# EAGLE schematic Motor_Test_Bench (EAGLE 9.5.0)
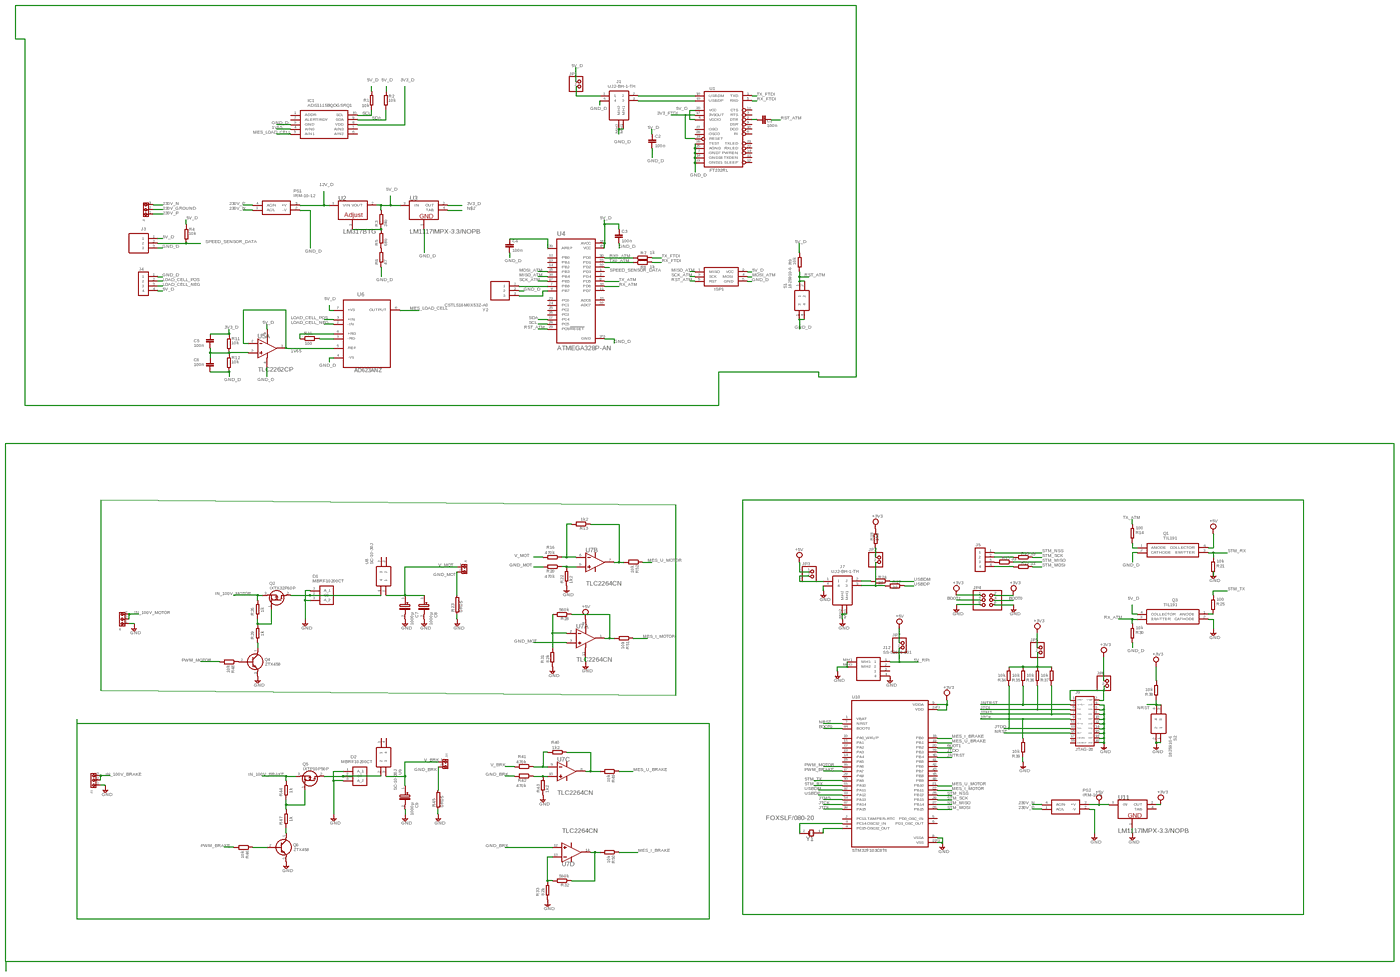
[diagram p0: schematic, sheet 1, overview]
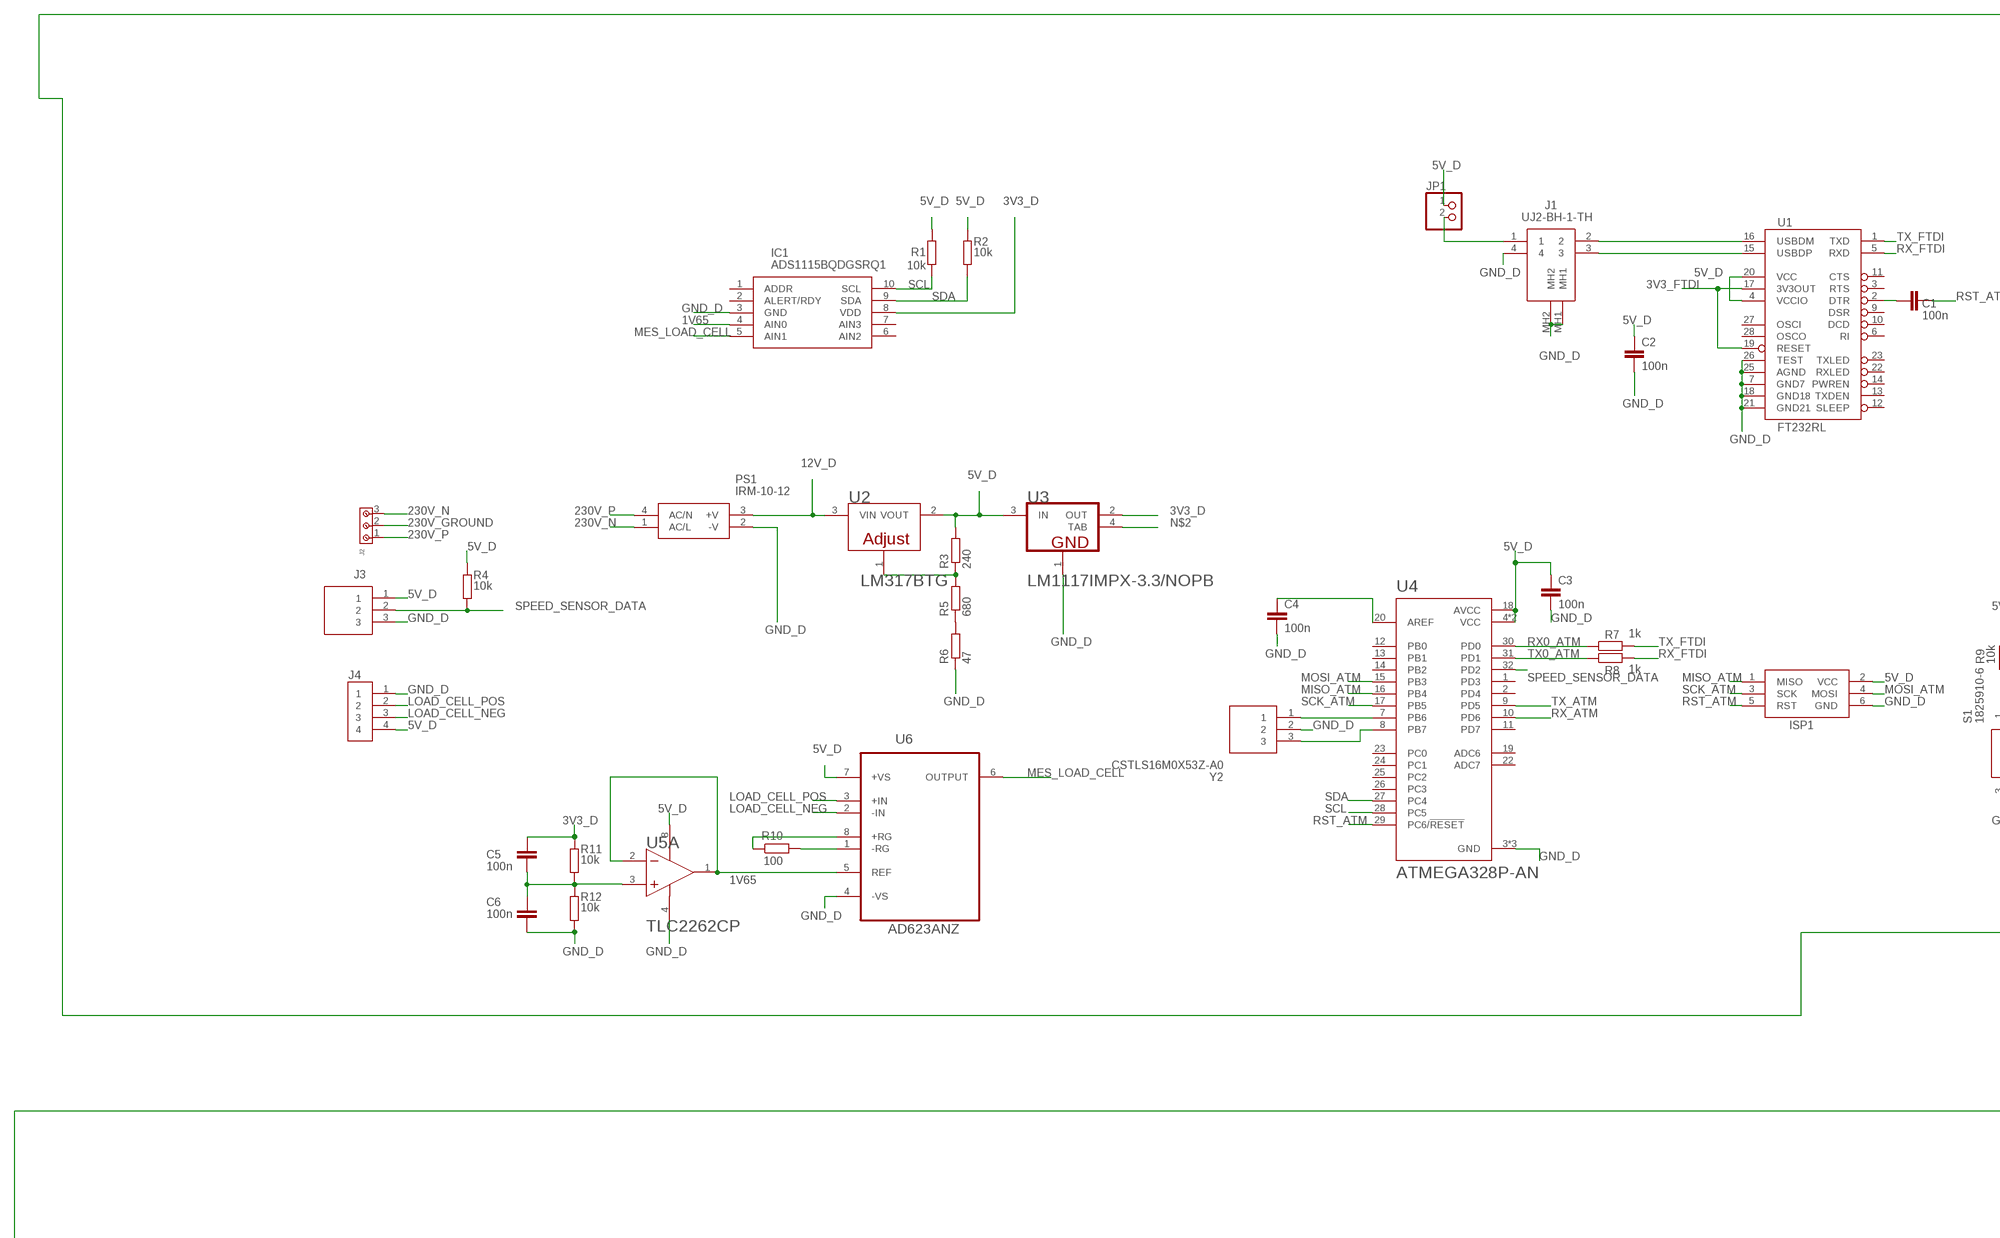
[diagram p1: schematic, sheet 1, part 1 of 4]
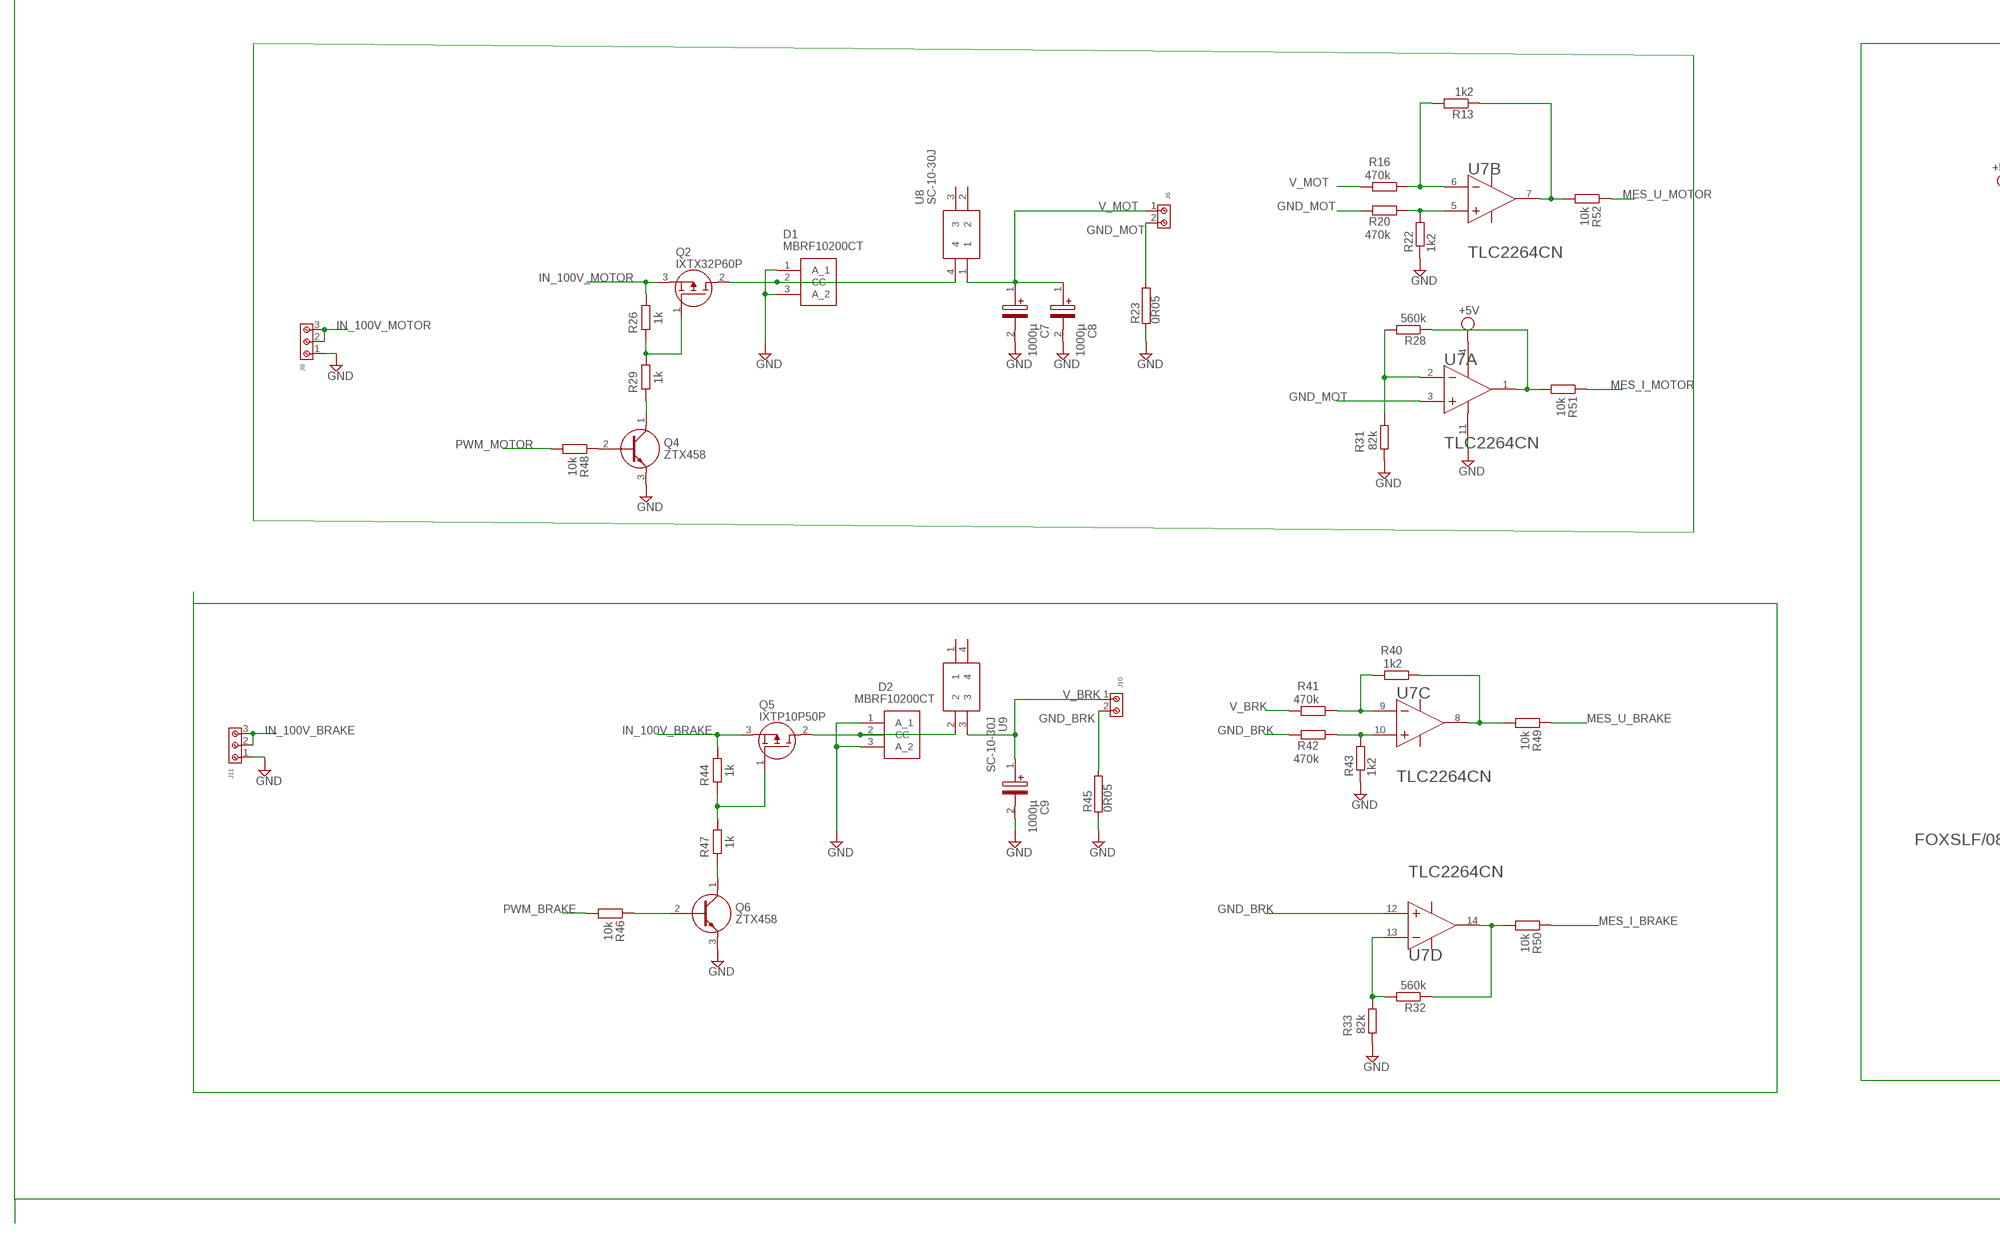
[diagram p2: schematic, sheet 1, part 2 of 4]
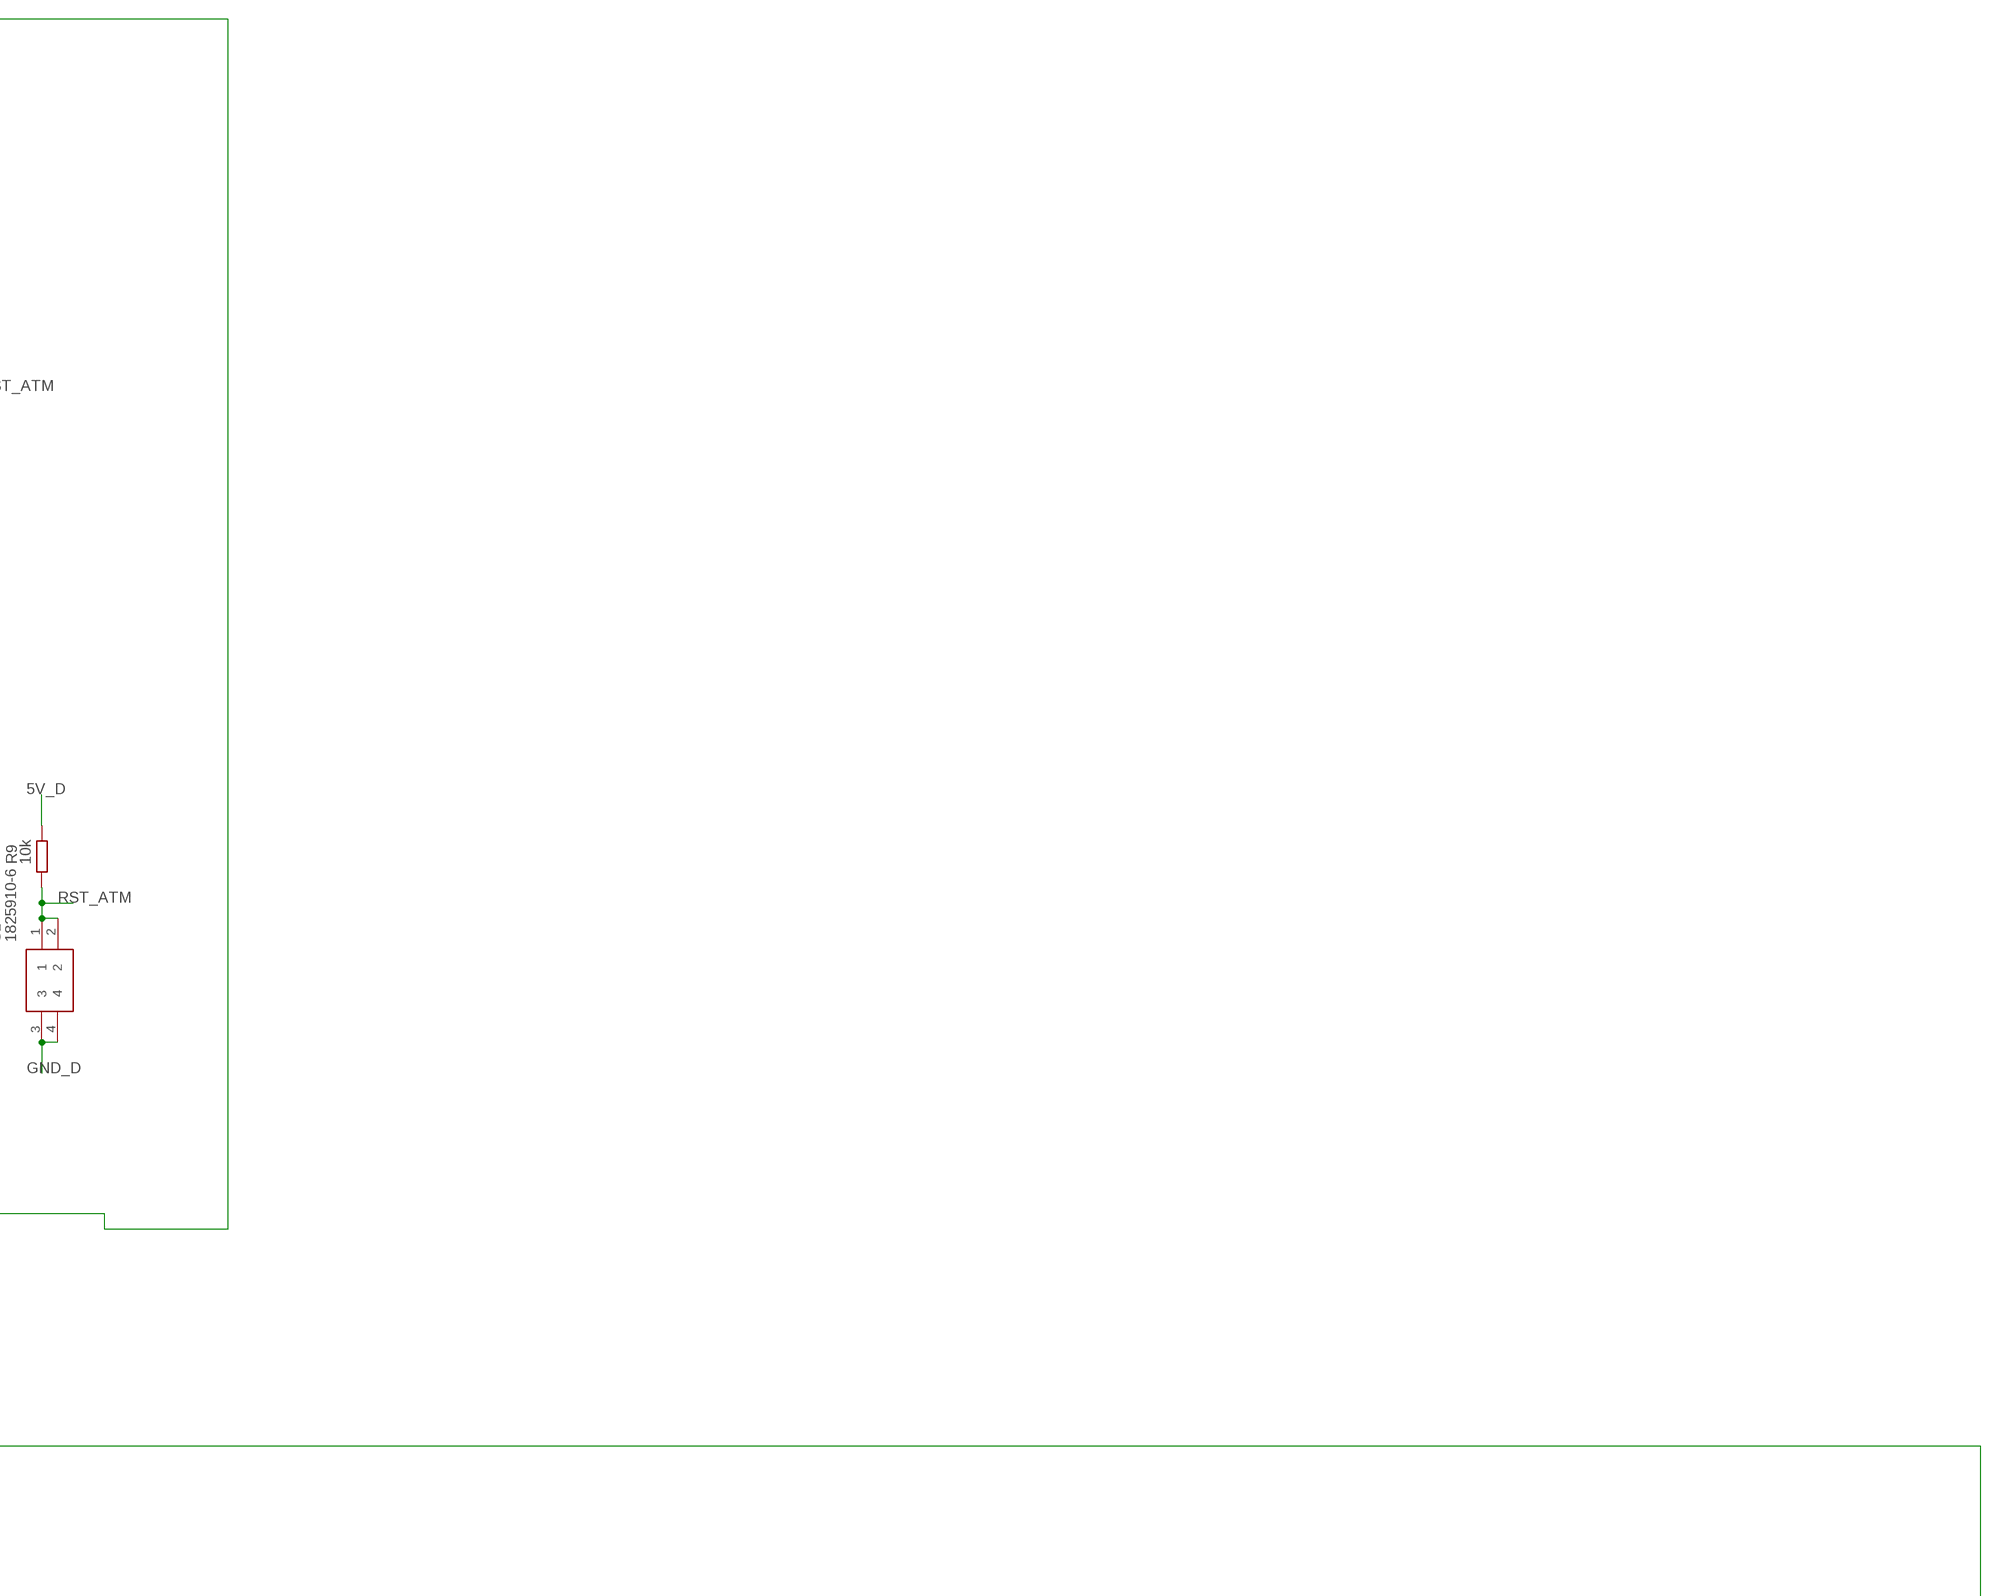
[diagram p3: schematic, sheet 1, part 3 of 4]
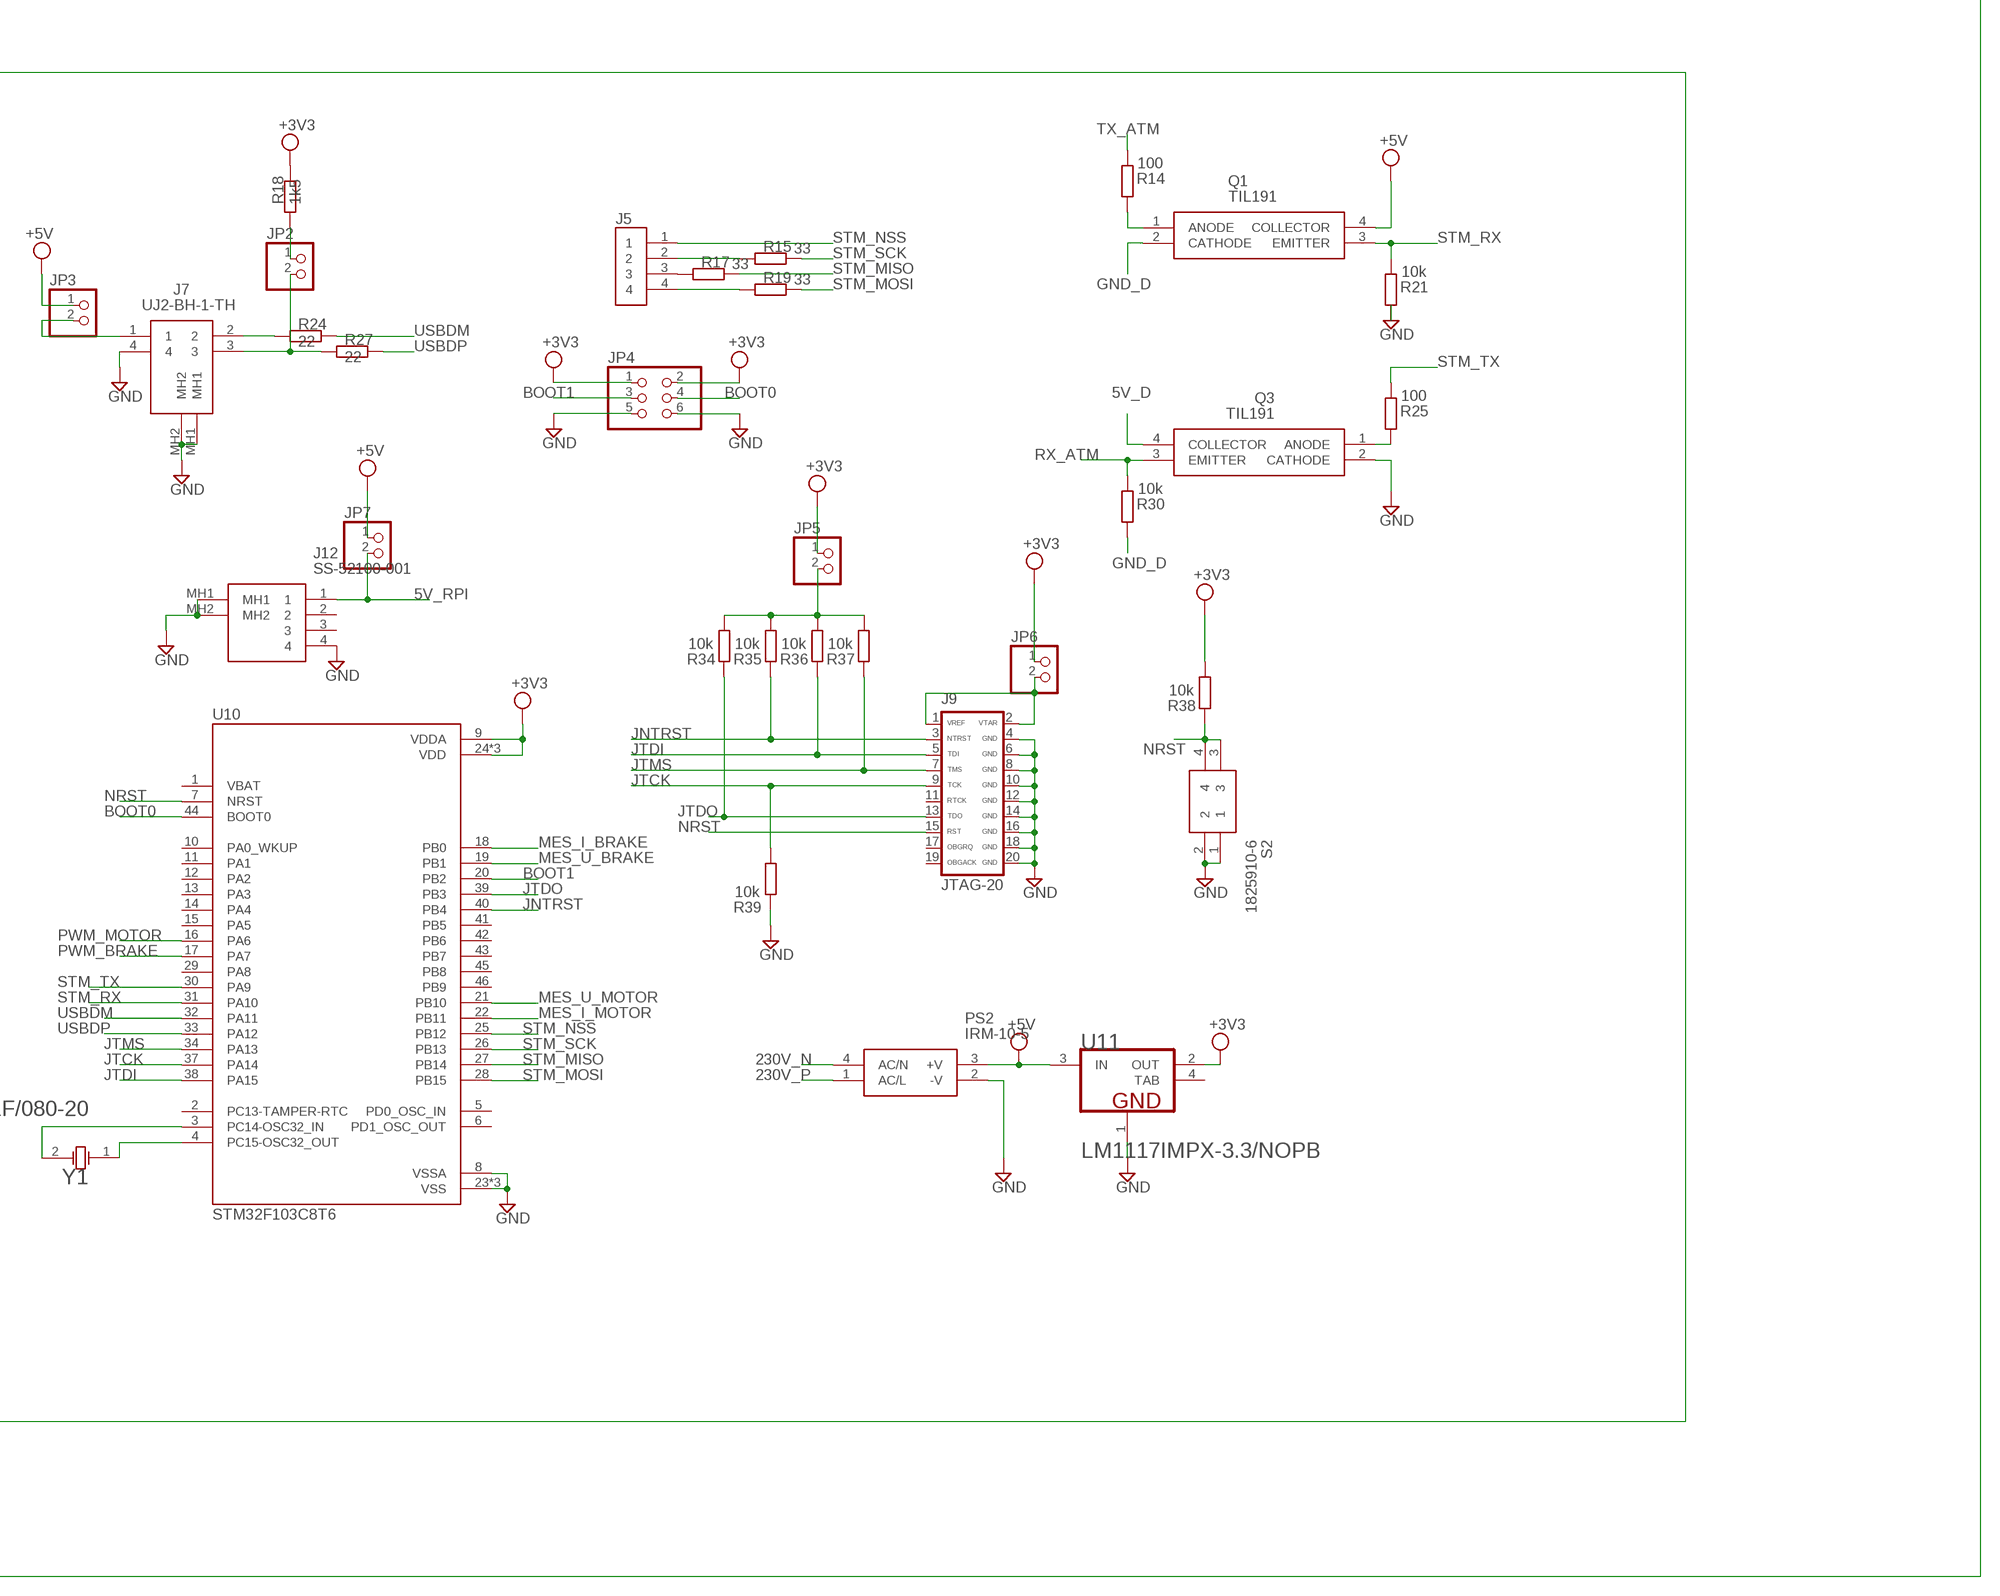
[diagram p4: schematic, sheet 1, part 4 of 4]

## Parts
C1  100n  CC0805KRX7R9BB104  [CAP_0805]
C2  100n  CC0805KRX7R9BB104  [CAP_0805]
C3  100n  CC0805KRX7R9BB104  [CAP_0805]
C4  100n  CC0805KRX7R9BB104  [CAP_0805]
C5  100n  C-EUC0805  [C0805]
C6  100n  C-EUC0805  [C0805]
C7  1000µ  SLPX102M200C4P3  [SLPX102M200C4P3]
C8  1000µ  SLPX102M200C4P3  [SLPX102M200C4P3]
C9  1000µ  SLPX102M200C4P3  [SLPX102M200C4P3]
D1  MBRF10200CT  [TO254P490X1000X2143-3P]
D2  MBRF10200CT  [TO254P490X1000X2143-3P]
IC1  ADS1115BQDGSRQ1  [SOP50P490X110-10N]
ISP1  AVRISP-6  [AVRISP]
J1  UJ2-BH-1-TH  [UJ2BH1TH]
J2  691210910003  [691210910003]
J3  B3B-XH-A(LF)(SN)  [SHDR3W64P0X250_1X3_990X575X700]
J4  B4B-XH-A(LF)(SN)  [JST_B4B-XH-A(LF)(SN)]
J5  B4B-XH-A(LF)(SN)  [JST_B4B-XH-A(LF)(SN)]
J6  691210910002  [691210910002]
J7  UJ2-BH-1-TH  [UJ2BH1TH]
J8  691210910003  [691210910003]
J9  JTAG-20  [JTAG-20]
J10  691210910002  [691210910002]
J11  691210910003  [691210910003]
J12  SS-52100-001  [SS52100001]
JP1  PINHD-1X2  [1X02]
JP2  PINHD-1X2  [1X02]
JP3  PINHD-1X2  [1X02]
JP4  PINHD-2X3  [2X03]
JP5  PINHD-1X2  [1X02]
JP6  PINHD-1X2  [1X02]
JP7  PINHD-1X2  [1X02]
PS1  IRM-10-12  [IRM-10]
PS2  IRM-10-5  [IRM-10]
Q1  TIL191  [DIP762W58P254L450H584Q4N]
Q2  IXTX32P60P  [TO545P521X1594X2566-3P]
Q3  TIL191  [DIP762W58P254L450H584Q4N]
Q4  ZTX458  [ZTX458]
Q5  IXTP10P50P  [TO254P483X1028X1700-3P]
Q6  ZTX458  [ZTX458]
R1  10k  R-EU_R0805  [R0805]
R2  10k  R-EU_R0805  [R0805]
R3  240  R-EU_R0805  [R0805]
R4  10k  R-EU_R0805  [R0805]
R5  680  R-EU_R0805  [R0805]
R6  47  R-EU_R0805  [R0805]
R7  1k  R-EU_R0805  [R0805]
R8  1k  R-EU_R0805  [R0805]
R9  10k  R-EU_R0805  [R0805]
R10  100  R-EU_R0805  [R0805]
R11  10k  R-EU_R0805  [R0805]
R12  10k  R-EU_R0805  [R0805]
R13  1k2  R-EU_R0805  [R0805]
R14  100  R-EU_R0805  [R0805]
R15  33  R-EU_M0805  [M0805]
R16  470k  R-EU_R0805  [R0805]
R17  33  R-EU_M0805  [M0805]
R18  1k5  R-EU_R0805  [R0805]
R19  33  R-EU_M0805  [M0805]
R20  470k  R-EU_R0805  [R0805]
R21  10k  R-EU_R0805  [R0805]
R22  1k2  R-EU_R0805  [R0805]
R23  0R05  RRS05_69-70  [RS05_69-70]
R24  22  R-EU_R0805  [R0805]
R25  100  R-EU_R0805  [R0805]
R26  1k  R-EU_0204/7  [0204/7]
R27  22  R-EU_R0805  [R0805]
R28  560k  R-EU_R0805  [R0805]
R29  1k  R-EU_0204/7  [0204/7]
R30  10k  R-EU_R0805  [R0805]
R31  82k  R-EU_R0805  [R0805]
R32  560k  R-EU_R0805  [R0805]
R33  82k  R-EU_R0805  [R0805]
R34  10k  R-EU_M0805  [M0805]
R35  10k  R-EU_M0805  [M0805]
R36  10k  R-EU_M0805  [M0805]
R37  10k  R-EU_M0805  [M0805]
R38  10k  R-EU_R0805  [R0805]
R39  10k  R-EU_M0805  [M0805]
R40  1k2  R-EU_R0805  [R0805]
R41  470k  R-EU_R0805  [R0805]
R42  470k  R-EU_R0805  [R0805]
R43  1k2  R-EU_R0805  [R0805]
R44  1k  R-EU_0204/7  [0204/7]
R45  0R05  RRS05_69-70  [RS05_69-70]
R46  10k  R-EU_0204/7  [0204/7]
R47  1k  R-EU_0204/7  [0204/7]
R48  10k  R-EU_0204/7  [0204/7]
R49  10k  R-EU_M0805  [M0805]
R50  10k  R-EU_M0805  [M0805]
R51  10k  R-EU_M0805  [M0805]
R52  10k  R-EU_M0805  [M0805]
S1  1825910-6  [1825910-6]
S2  1825910-6  [1825910-6]
U1  FT232RL  FT232RLSSOP  [SSOP28DB]
U2  ON_SEMI_LM317BTGON_SEMI_LM317BTG_0_0  [ON_SEMI_LM317BTG_0]
U3  NATIONAL_SEMICONDUCTOR_LM1117IMPX-3.3-NOPBNATIONAL_SEMICONDUCTOR_LM1117IMPX-3.3-NOPB_0_2  [NATIONAL_SEMICONDUCTOR_LM1117IMPX-3.3-NOPB_2]
U4  ATMEGA328P-AN  [QFP80P900X900X120-32N]
U5  TEXAS_INSTRUMENTS_TLC2262CPTEXAS_INSTRUMENTS_TLC2262CP_0_0  [TEXAS_INSTRUMENTS_TLC2262CP_0]
U6  AD623ANZ  [DIP254P762X533-8]
U7  TEXAS_INSTRUMENTS_TLC2264CNTEXAS_INSTRUMENTS_TLC2264CN_0_0  [TEXAS_INSTRUMENTS_TLC2264CN_0]
U8  SC-10-30J  [SC-10-30J]
U9  SC-10-30J  [SC-10-30J]
U10  STM32F103C8T6  [QFP50P900X900X160-48N]
U11  NATIONAL_SEMICONDUCTOR_LM1117IMPX-3.3-NOPBNATIONAL_SEMICONDUCTOR_LM1117IMPX-3.3-NOPB_0_2  [NATIONAL_SEMICONDUCTOR_LM1117IMPX-3.3-NOPB_2]
Y1  FOX_ELECTRONICS_FOXSLF-080-20FOX_ELECTRONICS_FOXSLF-080-20_0_0  [FOX_ELECTRONICS_FOXSLF-080-20_0]
Y2  CSTLS16M0X53Z-A0  [CSTLS16M0X53ZA0]

## Nets
1V65: IC1.4(AIN0) U5.1(A:OUT1) U5.2(A:IN1-) U6.5(REF)
3V3_D: C5.1 IC1.8(VDD) R11.1 U3.2(OUT)
3V3_FTDI: U1.17(3V3OUT) U1.19(RESET)
5V_D: C2.1 C3.1 ISP1.2(VCC) J3.1 J4.4 JP1.1 Q3.4(COLLECTOR) R1.2 R2.2 R3.2 R4.1 R9.2 U1.4(VCCIO) U1.20(VCC) U2.2(VOUT) U3.3(IN) U4.4(VCC) U4.6(VCC) U4.18(AVCC) U5.8(A:VDD+) U6.7(+VS)
5V_RPI: J12.1 JP7.2
12V_D: PS1.3(+V) U2.3(VIN)
230V_GROUND: J2.2
230V_N: J2.3 PS1.1(AC/L) PS2.4(AC/N)
230V_P: J2.1 PS1.4(AC/N) PS2.1(AC/L)
+3V3: JP4.1 JP4.2 JP5.1 JP6.1 R18.1 R38.2 U10.9(VDDA) U10.24(VDD) U10.36(VDD) U10.48(VDD) U11.2(OUT)
+5V: JP3.1 JP7.1 PS2.3(+V) Q1.4(COLLECTOR) U7.4(A:VDD+) U11.3(IN)
BOOT0: JP4.4 U10.44(BOOT0)
BOOT1: JP4.3 U10.20(PB2)
GND: C7.2(-) C8.2(-) C9.2(-) D1.1(A_1) D1.3(A_2) D2.1(A_1) D2.3(A_2) J7.4 J7.MH1 J7.MH2 J8.1 J9.4(GND) J9.6(GND) J9.8(GND) J9.10(GND) J9.12(GND) J9.14(GND) J9.16(GND) J9.18(GND) J9.20(GND) J11.1 J12.4 J12.MH1 J12.MH2 JP4.5 JP4.6 PS2.2(-V) Q3.2(CATHODE) Q4.3(C) Q6.3(C) R21.1 R22.1 R23.1 R31.2 R33.2 R39.1 R43.1 R45.1 S2.1 S2.2 U7.11(A:VDD-/GND) U10.8(VSSA) U10.23(VSS) U10.35(VSS) U10.47(VSS) U11.1(GND)
GND_BRK: J10.2 R42.2 R45.2 U7.12(D:IN4+)
GND_D: C2.2 C3.2 C4.2 C6.2 IC1.3(GND) ISP1.6(GND) J1.4 J1.MH1 J1.MH2 J3.3 J4.1 PS1.2(-V) Q1.2(CATHODE) R6.1 R12.2 R30.1 S1.3 S1.4 U1.7(GND7) U1.18(GND18) U1.21(GND21) U1.25(AGND) U1.26(TEST) U3.1(GND) U4.3(GND) U4.5(GND) U4.21(GND) U5.4(A:VDD-/GND) U6.4(-VS) Y2.2
GND_MOT: J6.2 R20.2 R23.2 U7.3(A:IN1+)
IN_100V_BRAKE: J11.2 J11.3 Q5.3(S) R44.2
IN_100V_MOTOR: J8.2 J8.3 Q2.3(S) R26.2
JNTRST: J9.3(NTRST) R35.1 U10.40(PB4)
JTCK: J9.9(TCK) R39.2 U10.37(PA14)
JTDI: J9.5(TDI) R36.1 U10.38(PA15)
JTDO: J9.13(TDO) R34.1 U10.39(PB3)
JTMS: J9.7(TMS) R37.1 U10.34(PA13)
LOAD_CELL_NEG: J4.3 U6.2(-IN)
LOAD_CELL_POS: J4.2 U6.3(+IN)
MES_I_BRAKE: R50.1 U10.18(PB0)
MES_I_MOTOR: R51.1 U10.22(PB11)
MES_LOAD_CELL: IC1.5(AIN1) U6.6(OUTPUT)
MES_U_BRAKE: R49.1 U10.19(PB1)
MES_U_MOTOR: R52.1 U10.21(PB10)
MISO_ATM: ISP1.1(MISO) U4.16(PB4)
MOSI_ATM: ISP1.4(MOSI) U4.15(PB3)
N$1: D1.2(CC) Q2.2(D) U8.4
N$2: U3.4(TAB)
N$3: R5.1 R6.2
N$5: R3.1 R5.2 U2.1(ADJUST)
N$6: J7.2 R24.2
N$7: J7.3 JP2.2 R27.2
N$8: JP2.1 R18.2
N$9: R28.2 R31.1 U7.2(A:IN1-)
N$10: Q2.1(G) R26.1 R29.2
N$11: Q4.1(E) R29.1
N$12: R13.2 R16.1 U7.6(B:IN2-)
N$13: R20.1 R22.2 U7.5(B:IN2+)
N$14: C1.2 U1.2(DTR)
N$15: C4.1 U4.20(AREF)
N$16: Q5.1(G) R44.1 R47.2
N$17: R32.2 R33.1 U7.13(D:IN4-)
N$18: Q6.2(B) R46.1
N$19: R42.1 R43.2 U7.10(C:IN3+)
N$20: R40.2 R41.1 U7.9(C:IN3-)
N$21: Q4.2(B) R48.1
N$22: Q6.1(E) R47.1
N$23: R28.1 R51.2 U7.1(A:OUT1)
N$25: J1.2 U1.16(USBDM)
N$26: R10.2 U6.1(-RG)
N$27: C5.2 C6.1 R11.2 R12.1 U5.3(A:IN1+)
N$28: R10.1 U6.8(+RG)
N$29: J1.3 U1.15(USBDP)
N$32: D2.2(CC) Q5.2(D) U9.2
N$34: Q1.1(ANODE) R14.1
N$35: Q3.1(ANODE) R25.1
N$36: J7.1 JP3.2
N$37: J9.1(VREF) J9.2(VTAR) JP6.2
N$38: JP5.2 R34.2 R35.2 R36.2 R37.2
N$39: J1.1 JP1.2
N$40: J5.2 R15.2
N$41: J5.3 R17.2
N$42: J5.4 R19.2
N$43: U10.4(PC15-OSC32_OUT) Y1.1
N$44: U10.3(PC14-OSC32_IN) Y1.2
N$45: R32.1 R50.2 U7.14(D:OUT4)
N$46: R40.1 R49.2 U7.8(C:OUT3)
N$47: R13.1 R52.2 U7.7(B:OUT2)
N$48: U4.7(PB6) Y2.1
N$49: U4.8(PB7) Y2.3
NRST: J9.15(RST) R38.1 S2.3 S2.4 U10.7(NRST)
PWM_BRAKE: R46.2 U10.17(PA7)
PWM_MOTOR: R48.2 U10.16(PA6)
RST_ATM: C1.1 ISP1.5(RST) R9.1 S1.1 S1.2 U4.29(PC6/!RESET)
RX0_ATM: R7.1 U4.30(PD0)
RX_ATM: Q3.3(EMITTER) R30.2 U4.10(PD6)
RX_FTDI: R8.2 U1.5(RXD)
SCK_ATM: ISP1.3(SCK) U4.17(PB5)
SCL: IC1.10(SCL) R1.1 U4.28(PC5)
SDA: IC1.9(SDA) R2.1 U4.27(PC4)
SPEED_SENSOR_DATA: J3.2 R4.2 U4.32(PD2)
STM_MISO: R17.1 U10.27(PB14)
STM_MOSI: R19.1 U10.28(PB15)
STM_NSS: J5.1 U10.25(PB12)
STM_RX: Q1.3(EMITTER) R21.2 U10.31(PA10)
STM_SCK: R15.1 U10.26(PB13)
STM_TX: R25.2 U10.30(PA9)
TX0_ATM: R8.1 U4.31(PD1)
TX_ATM: R14.2 U4.9(PD5)
TX_FTDI: R7.2 U1.1(TXD)
USBDM: R24.1 U10.32(PA11)
USBDP: R27.1 U10.33(PA12)
V_BRK: C9.1(+) J10.1 R41.2 U9.3
V_MOT: C7.1(+) C8.1(+) J6.1 R16.2 U8.1
Unconnected: IC1.1(ADDR) IC1.2(ALERT/RDY) IC1.6(AIN2) IC1.7(AIN3) J9.11(RTCK) J9.17(OBGRQ) J9.19(OBGACK) J12.2 J12.3 U1.3(RTS) U1.6(RI) U1.9(DSR) U1.10(DCD) U1.11(CTS) U1.12(SLEEP) U1.13(TXDEN) U1.14(PWREN) U1.22(RXLED) U1.23(TXLED) U1.27(OSCI) U1.28(OSCO) U4.1(PD3) U4.2(PD4) U4.11(PD7) U4.12(PB0) U4.13(PB1) U4.14(PB2) U4.19(ADC6) U4.22(ADC7) U4.23(PC0) U4.24(PC1) U4.25(PC2) U4.26(PC3) U5.5(B:IN2+) U5.6(B:IN2-) U5.7(B:OUT2) U8.2 U8.3 U9.1 U9.4 U10.1(VBAT) U10.2(PC13-TAMPER-RTC) U10.5(PD0_OSC_IN) U10.6(PD1_OSC_OUT) U10.10(PA0_WKUP) U10.11(PA1) U10.12(PA2) U10.13(PA3) U10.14(PA4) U10.15(PA5) U10.29(PA8) U10.41(PB5) U10.42(PB6) U10.43(PB7) U10.45(PB8) U10.46(PB9)

## Power pins joined to a net without a drawn wire
TAB: U11.4(TAB)

## Library data of the parts
C1-C4 = Resistor_Capacitor:CC0805KRX7R9BB104: CAP CER 0.1UF 50V X7R 0805 Manufacturer's datasheet <http://www.yageo.com/documents/recent/UPY-GPHC_X7R_6.3V-to-50V_18.pdf>; CREATED_BY: PCBLayout.com; DIGIKEY_PART_NUMBER: 311-1140-2-ND; MANUFACTURER: Yageo; MPN: CC0805KRX7R9BB104; PACKAGE: SMD 0805
C5 C6 = resistor:C-EU: CAPACITOR, European symbol
C7-C9 = SamacSys_Parts:SLPX102M200C4P3: Cornell-Dubilier 1000uF Electrolytic Capacitor 200V dc Through Hole - SLPX102M200C4P3 Source: Datasheet <http://uk.rs-online.com/web/p/products/7441199P>; DESCRIPTION: Cornell-Dubilier 1000uF Electrolytic Capacitor 200V dc Through Hole - SLPX102M200C4P3; HEIGHT: 47mm; MANUFACTURER_NAME: Cornell Dubilier; MANUFACTURER_PART_NUMBER: SLPX102M200C4P3; RS_PART_NUMBER: 7441199P; RS_PRICE-STOCK: http://uk.rs-online.com/web/p/products/7441199P
D1 D2 = SamacSys_Parts:MBRF10200CT: DIODE SCHOTTKY 5A ITO220AB Source: Datasheet <https://componentsearchengine.com/Datasheets/1/MBRF10200CT.pdf>; DESCRIPTION: DIODE SCHOTTKY 5A ITO220AB; HEIGHT: 4.9mm; MANUFACTURER_NAME: Diodes Inc.; MANUFACTURER_PART_NUMBER: MBRF10200CT; MOUSER_PART_NUMBER: 621-MBRF10200CT; MOUSER_PRICE-STOCK: https://www.mouser.com/Search/Refine.aspx?Keyword=621-MBRF10200CT
IC1 = SamacSys_Parts:ADS1115BQDGSRQ1: Automotive 16-Bit 860SPS 4-Ch Delta-Sigma ADC With PGA, Oscillator, VREF, Comparator, and I2C Source: Datasheet <http://www.ti.com/lit/gpn/ads1115-q1>; DESCRIPTION: Automotive 16-Bit 860SPS 4-Ch Delta-Sigma ADC With PGA, Oscillator, VREF, Comparator, and I2C; HEIGHT: 1.1mm; MANUFACTURER_NAME: Texas Instruments; MANUFACTURER_PART_NUMBER: ADS1115BQDGSRQ1; MOUSER_PART_NUMBER: 595-ADS1115BQDGSRQ1; MOUSER_PRICE-STOCK: https://www.mouser.com/Search/Refine.aspx?Keyword=595-ADS1115BQDGSRQ1
ISP1 = adafruit:AVRISP: AVR ISP HEADER Standard 6 pin header for AVR programming
J1 J7 = SamacSys_Parts:UJ2-BH-1-TH: USB Connectors USB 2.0 type B jack 4 pin Horizontal TH Source: Datasheet <https://componentsearchengine.com/Datasheets/1/UJ2-BH-1-TH.pdf>; DESCRIPTION: USB Connectors USB 2.0 type B jack 4 pin Horizontal TH; HEIGHT: 10mm; MANUFACTURER_NAME: CUI Devices; MANUFACTURER_PART_NUMBER: UJ2-BH-1-TH; MOUSER_PART_NUMBER: 490-UJ2-BH-1-TH; MOUSER_PRICE-STOCK: https://www.mouser.com/Search/Refine.aspx?Keyword=490-UJ2-BH-1-TH
J2 J8 J11 = Wurth_Connectors_WR-TBL Rising Cage Clamp:691210910003: WR-TBL Serie 2109 - 2.54 mm Horiz. Entry KIND PROPERTIES Pitch 2.54 mm MATERIAL PROPERTIES Insulator Material PA66 Insulator Flammability Rating UL94 V-0 Insulator Color Green Contact Material Brass Contact Plating Copper over Zinc Terminal Screw Material Steel Terminal Screw Plating Zinc Wire Guard Material Brass GENERAL INFORMATION Operating Temperature -40 up to +105 °C Compliance Lead free / RoHS ELECTRICAL PROPERTIES IR cULus 6 A Working Voltage [cULus] 150 V (AC) Withstanding Voltage [cULus] 1300 V (AC) Contact Resistance [cULus] 20 mΩ MECHANICAL PROPERTIES Wire Strip Length 4 up to 5 (mm) Screw M1.6 Solid Wire Section (AWG) 30 to 18 (AWG) Solid Wire Section (Metric) 0.0509 to 0.823 (mm²) Stranded Wire Section (AWG) 30 to 18 (AWG) Stranded Wire Section (Metric) 0.0509 to 0.823 (mm²) CERTIFICATION cULus Approval E315414 PACKAGING PROPERTIES Packaging Box <https://katalog.we-online.com/media/images/v2/o33231v209%20Family_WR-TBL_69121091000x.jpg> Details see: https://katalog.we-online.com/en/em/TBL_2_54_2109_HORIZONTAL_ENTRY_69121091000X Updated by Ella Wu 2019-11-12 2019(C) Wurth Elektronik; DATASHEET-URL: https://www.we-online.com/catalog/datasheet/691210910003.pdf; IR-UL: 6A; MOUNT: THT; PART-NUMBER: 691210910003; PINS: 3; PITCH: 2.54mm; TYPE: Horizontal; WIRE: 30 to 18 (AWG) 0.0509 to 0.823 (mm²); WORKING-VOLTAGE-UL: 150V (AC)
J3 = SamacSys_Parts:B3B-XH-A(LF)(SN): XH-2.5mm Header top entry 3 way JST XH Series, Series Number B3B, 2.5mm Pitch 3 Way 1 Row Straight PCB Header, Solder Termination, 3A Source: Datasheet; DESCRIPTION: XH-2.5mm Header top entry 3 way JST XH Series, Series Number B3B, 2.5mm Pitch 3 Way 1 Row Straight PCB Header, Solder Termination, 3A; HEIGHT: 7mm; MANUFACTURER_NAME: JST (JAPAN SOLDERLESS TERMINALS); MANUFACTURER_PART_NUMBER: B3B-XH-A(LF)(SN)
J4 J5 = B4B-XH-A_LF__SN_:B4B-XH-A(LF)(SN): XH Series 4 Position 2.5 mm Pitch Through Hole Crimp Top Entry Shrouded Header; AVAILABILITY: Unavailable; DESCRIPTION: Connector Header Through Hole 4 position 0.098 _2.50mm_; MF: JST Sales; MP: B4B-XH-A_LF__SN_; PACKAGE: None; PRICE: None
J6 J10 = Wurth_Connectors_WR-TBL Rising Cage Clamp:691210910002: WR-TBL Serie 2109 - 2.54 mm Horiz. Entry KIND PROPERTIES Pitch 2.54 mm MATERIAL PROPERTIES Insulator Material PA66 Insulator Flammability Rating UL94 V-0 Insulator Color Green Contact Material Brass Contact Plating Copper over Zinc Terminal Screw Material Steel Terminal Screw Plating Zinc Wire Guard Material Brass GENERAL INFORMATION Operating Temperature -40 up to +105 °C Compliance Lead free / RoHS ELECTRICAL PROPERTIES IR cULus 6 A Working Voltage [cULus] 150 V (AC) Withstanding Voltage [cULus] 1300 V (AC) Contact Resistance [cULus] 20 mΩ MECHANICAL PROPERTIES Wire Strip Length 4 up to 5 (mm) Screw M1.6 Solid Wire Section (AWG) 30 to 18 (AWG) Solid Wire Section (Metric) 0.0509 to 0.823 (mm²) Stranded Wire Section (AWG) 30 to 18 (AWG) Stranded Wire Section (Metric) 0.0509 to 0.823 (mm²) CERTIFICATION cULus Approval E315414 PACKAGING PROPERTIES Packaging Box <https://katalog.we-online.com/media/images/v2/o33231v209%20Family_WR-TBL_69121091000x.jpg> Details see: https://katalog.we-online.com/en/em/TBL_2_54_2109_HORIZONTAL_ENTRY_69121091000X Updated by Ella Wu 2019-11-12 2019(C) Wurth Elektronik; DATASHEET-URL: https://www.we-online.com/catalog/datasheet/691210910002.pdf; IR-UL: 6A; MOUNT: THT; PART-NUMBER: 691210910002; PINS: 2; PITCH: 2.54mm; TYPE: Horizontal; WIRE: 30 to 18 (AWG) 0.0509 to 0.823 (mm²); WORKING-VOLTAGE-UL: 150V (AC)
J9 = luminary-arm:JTAG-20: JTAG 20-Pin Programming/Debug Connector
J12 = SamacSys_Parts:SS-52100-001: STEWART CONNECTOR - SS-52100-001 - USB CONN, 2.0 TYPE A, RCPT, 4POS, TH Source: Datasheet <https://componentsearchengine.com/Datasheets/1/SS-52100-001.pdf>; DESCRIPTION: STEWART CONNECTOR - SS-52100-001 - USB CONN, 2.0 TYPE A, RCPT, 4POS, TH; HEIGHT: 6.9mm; MANUFACTURER_NAME: Bel-Stewart; MANUFACTURER_PART_NUMBER: SS-52100-001; MOUSER_PART_NUMBER: 530-SS-52100-001; MOUSER_PRICE-STOCK: https://www.mouser.com/Search/Refine.aspx?Keyword=530-SS-52100-001
JP1-JP3 JP5-JP7 = DC_LOAD_AU:PINHD-1X2: PIN HEADER
JP4 = pinhead:PINHD-2X3: PIN HEADER
PS1 = SamacSys_Parts:IRM-10-12: Power Supply Encapsulated PCB 12V 10W Source: Datasheet <http://uk.rs-online.com/web/p/products/1358930>; ALLIED_NUMBER: 70387819; DESCRIPTION: Power Supply Encapsulated PCB 12V 10W; HEIGHT: mm; MANUFACTURER_NAME: Mean Well; MANUFACTURER_PART_NUMBER: IRM-10-12; RS_PART_NUMBER: 1358930; RS_PRICE-STOCK: http://uk.rs-online.com/web/p/products/1358930
PS2 = SamacSys_Parts:IRM-10-5: AC/DC Power Modules 5V 2A 10W 85-264Vin Encap PS Source: Datasheet <http://uk.rs-online.com/web/p/products/1358929>; ALLIED_NUMBER: 70387823; DESCRIPTION: AC/DC Power Modules 5V 2A 10W 85-264Vin Encap PS; HEIGHT: mm; MANUFACTURER_NAME: Mean Well; MANUFACTURER_PART_NUMBER: IRM-10-5; RS_PART_NUMBER: 1358929; RS_PRICE-STOCK: http://uk.rs-online.com/web/p/products/1358929
Q1 Q3 = SamacSys_Parts:TIL191: Optocoupler DC-IN 1-CH Transistor DC-OUT 4-Pin PDIP Source: Datasheet; DESCRIPTION: Optocoupler DC-IN 1-CH Transistor DC-OUT 4-Pin PDIP; HEIGHT: 5.84mm; MANUFACTURER_NAME: Isocom; MANUFACTURER_PART_NUMBER: TIL191
Q2 = SamacSys_Parts:IXTX32P60P: MOSFET -32 Amps -600V 0.350 Rds Source: Datasheet <https://componentsearchengine.com/Datasheets/1/IXTX32P60P.pdf>; DESCRIPTION: MOSFET -32 Amps -600V 0.350 Rds; HEIGHT: 5.21mm; MANUFACTURER_NAME: IXYS SEMICONDUCTOR; MANUFACTURER_PART_NUMBER: IXTX32P60P; MOUSER_PART_NUMBER: 747-IXTX32P60P; MOUSER_PRICE-STOCK: https://www.mouser.com/Search/Refine.aspx?Keyword=747-IXTX32P60P
Q4 Q6 = SamacSys_Parts:ZTX458: Transistor,NPN,0.5A,400V,E-Line Source: Datasheet <https://componentsearchengine.com/Datasheets/1/ZTX458.pdf>; DESCRIPTION: Transistor,NPN,0.5A,400V,E-Line; HEIGHT: 4.01mm; MANUFACTURER_NAME: Diodes Inc.; MANUFACTURER_PART_NUMBER: ZTX458; MOUSER_PART_NUMBER: 522-ZTX458; MOUSER_PRICE-STOCK: https://www.mouser.com/Search/Refine.aspx?Keyword=522-ZTX458
Q5 = SamacSys_Parts:IXTP10P50P: MOSFET -10.0 Amps -500V 1.000 Rds Source: Datasheet <https://componentsearchengine.com/Datasheets/1/IXTP10P50P.pdf>; DESCRIPTION: MOSFET -10.0 Amps -500V 1.000 Rds; HEIGHT: 4.83mm; MANUFACTURER_NAME: IXYS SEMICONDUCTOR; MANUFACTURER_PART_NUMBER: IXTP10P50P; MOUSER_PART_NUMBER: 747-IXTP10P50P; MOUSER_PRICE-STOCK: https://www.mouser.com/Search/Refine.aspx?Keyword=747-IXTP10P50P
R1-R22 R24-R44 R46-R52 = resistor:R-EU_: RESISTOR, European symbol
R23 R45 = resistor-power:R: Power Resitor; OC_FARNELL: unknown; OC_NEWARK: unknown
S1 S2 = SamacSys_Parts:1825910-6: TE CONNECTIVITY / ALCOSWITCH - 1825910-6 - TACT SWITCH, SPST, 0.05A, 24VDC, SOLDER Source: Datasheet; DESCRIPTION: TE CONNECTIVITY / ALCOSWITCH - 1825910-6 - TACT SWITCH, SPST, 0.05A, 24VDC, SOLDER; HEIGHT: mm; MANUFACTURER_NAME: TE Connectivity; MANUFACTURER_PART_NUMBER: 1825910-6; MOUSER_PART_NUMBER: N/A; MOUSER_PRICE-STOCK: https://www.mouser.com/Search/Refine.aspx?Keyword=N%2FA
U1 = SparkFun-IC-Comms:FT232RL: FT232RL USB UART FT232RL 4th Generation USB UART (USB <-> Serial) Controller. Datasheet <http://www.sparkfun.com/datasheets/IC/FT232R_v104.pdf> SparkFun Products Component <https://www.sparkfun.com/products/650> (COM-00650) SparkFun RedBot Mainboard <https://www.sparkfun.com/products/12097> (ROB-12097) SparkFun FTDI Basic Breakout - 5V <https://www.sparkfun.com/products/9716> (DEV-09716) SparkFun FTDI Basic Breakout - 3.3V <https://www.sparkfun.com/products/9873> (DEV-09873) Bus Pirate - v3.6a <https://www.sparkfun.com/products/12942> (TOL-12942) SparkFun USB to Serial Breakout - FT232RL <https://www.sparkfun.com/products/12731> (BOB-12731) SparkFun PicoBoard <https://www.sparkfun.com/products/11888> (WIG-11888) SparkFun RFID USB Reader <https://www.sparkfun.com/products/9963> (SEN-09963) LilyPad FTDI Basic Breakout - 5V <https://www.sparkfun.com/products/10275> (DEV-10275) SparkFun Stepoko <https://www.sparkfun.com/products/13899> (ROB-13899); PROD_ID: IC-00870
U2 = ON Semi - LM317BTG:ON_SEMI_LM317BTG: LDO Regulator Pos 1.2V to 37V 0.4A 3-Pin(3+Tab) TO-220 Rail; CENTROID_NOT_SPECIFIED: No; DATASHEET: http://www.onsemi.com/pub/Collateral/LM317-D.PDF; DEVICE_CLASS_L1: Integrated Circuits (ICs); DEVICE_CLASS_L2: Power Management ICs; DEVICE_CLASS_L3: Voltage Regulators - Linear; DIGIKEY_DESCRIPTION: IC REG LIN POS ADJ 1.5A TO220AB; DIGIKEY_PART_NUMBER: LM317BTGOS-ND; FOOTPRINT_PARAMETERS_0: {"fp_type":"TO220","params":{"N":{"long name":"Number of leads","type":"fixed","short name":"N","value":3},"A":{"nom":false,"long name":"Total height","min":14480000,"max":15750000,"short name":"A","type":"measurement"},"A1":{"nom":false,"long name":"Package clearance","min":2800000,"max":3930000,"short name":"A1","type":"measurement"},"D":{"nom":false,"long name":"Package length","min":9660000,"max":10280000,"short name":"D","type":"measurement"},"E":{"nom":false,"long name":"Package width","min":4070000,"max":4820000,"short name":"E","type":"measurement"},"B":{"nom":false,"long name":"Lead width","min":640000,"max":880000,"short name":"B","type":"measurement"},"C":{"nom":false,"long name":"Lead thickness","min":460000,"max":640000,"short name":"C","type":"measurement"},"e":{"nom":2540000,"long name":"Lead pitch","min":null,"max":null,"short name":"e","type":"measurement"},"offset x":{"nom":0,"long name":"X Center offset","min":null,"max":null,"short name":"offset x","type":"measurement"},"offset y":{"nom":0,"long name":"Y Center offset","min":null,"max":null,"short name":"offset y","type":"measurement"},"LS":{"default":"Circle","long name":"Land shape","type":"multichoice","short name":"LS"},"LS1":{"default":"Square","long name":"Land shape (Pin 1)","type":"multichoice","short name":"LS1"}}}; FOOTPRINT_URL: http://www.onsemi.com/pub/Collateral/221AB.PDF; HEIGHT: 15.75mm; IPC_LAND_PATTERN_NAME: TO-220; LEAD_FREE: yes; MAX_JUNCTION_TEMP: +150°C; MF: ON Semi; MFG_PACKAGE_IDENT: 221AB-01; MFG_PACKAGE_IDENT_DATE: 11/2010; MFG_PACKAGE_IDENT_REV: A; MOUSER_DESCRIPTION: Linear Voltage Regulators 1.5A ADJ 1.2-37V Positive; MOUSER_PART_NUMBER: 863-LM317BTG; MPN: LM317BTG; NUMBER_OF_OUTPUTS: 1; OUTPUT_CURRENT: 1.5A; OUTPUT_VOLTAGE: 1.2-37V; PACKAGE: TO-220-3; PREFIX: U; ROHS: yes; TEMPERATURE_RANGE_HIGH: +125°C; TEMPERATURE_RANGE_LOW: -40°C; VERIFICATION_VERSION: 0.0.0.1
U3 U11 = LM1117IMPX:NATIONAL_SEMICONDUCTOR_LM1117IMPX-3.3-NOPB: PM-REG-LM1086-SOT4; CIIVA_IDS: 1248290; CODE__IPC: SOT223-4; CODE__JEDEC: TO-261-AA; COMPONENT_LINK_1_DESCRIPTION: Manufacturer URL; COMPONENT_LINK_1_URL: http://www.national.com/; COMPONENT_LINK_2_DESCRIPTION: LM1117 Datasheet; COMPONENT_LINK_2_URL: http://www.national.com/ds/LM/LM1117.pdf; COMPONENT_LINK_3_DESCRIPTION: LM1117 Web Page; COMPONENT_LINK_3_URL: http://www.national.com/pf/LM/LM1117.html; COMPONENT_LINK_4_DESCRIPTION: MP04A Package Page; COMPONENT_LINK_4_URL: http://www.national.com/packaging/folders/mp04a.html; COMP_TYPE: LDO IC; DATASHEET_VERSION: Apr-2006; FOOTPRINT_VARIANT_NAME_0: Level C; FOOTPRINT_VARIANT_NAME_1: Level B; FOOTPRINT_VARIANT_NAME_2: Level A; HIGH__RELIABILITY: Y; IMPORTED: yes; IMPORTED_FROM: vault; IMPORT_TS: 1521844797; MF: National Semiconductor; MPN: LM1117IMPX-3.3/NOPB; PACKAGE: MP04A; PACKAGE_DESCRIPTION: Molded SOT-223, 6.50 x 3.56 x 1.6mm Body, 4 Lead, 2.3mm Pitch; PACKAGE_TOP_MARKING: XYTT*N05B; PACKAGE_VERSION: revB, Apr-2003; PIN_COUNT: 4; POWER_WISE: N; PREFIX: U; RELEASE_DATE: 1348562355; ROHS: Yes; VAULT_GUID: 5347B544-0EC6-4DDA-9FFD-45A5015DD418; VAULT_REVISION: 9ED12BCD-7A1F-4365-A91F-B783ED43257B
U4 = ATMEGA328P-AN:ATMEGA328P-AN: ATmega Series 20 MHz 32 KB Flash 2 KB SRAM 8-Bit Microcontroller - TQFP-32; AVAILABILITY: Unavailable; DESCRIPTION: MCU 8-bit ATmega AVR RISC 32KB Flash 2.5V/3.3V/5V 32-Pin TQFP Tray; MF: Microchip; MP: ATMEGA328P-AN; PACKAGE: TQFP-32 Microchip; PRICE: None
U5 = Texas Instruments - TLC2262CP:TEXAS_INSTRUMENTS_TLC2262CP: TI-TLV_C2XX2_TLC4502-8; CIIVA_IDS: 13615378; CMRR_MIND_B: 70; CODE__JEDEC: MS-001; COMPONENT_LINK_1_DESCRIPTION: Manufacturer URL; COMPONENT_LINK_1_URL: http://www.ti.com/; COMPONENT_LINK_3_DESCRIPTION: Package Specification; COMPONENT_LINK_3_URL: http://www.ti.com/litv/pdf/mpdi001b; DATASHEET: http://www.ti.com/lit/ds/symlink/tlc2262.pdf; DATASHEET_VERSION: SLOS177D; ECO__PLAN: Pb-Free (RoHS); FOOTPRINT_VARIANT_NAME_0: Manufacturer Recommended; GBW_TYP_MHZ: 0.71; IIB_MAXP_A: 100; IMPORTED: yes; IMPORTED_FROM: vault; IMPORT_TS: 1521844264; IQ_PER_CHANNELMAXMA: 0.25; MF: Texas Instruments; MOUNTING_TECHNOLOGY: Through Hole; MPN: TLC2262CP; NUMBER_OF_CHANNELS: 2; OFFSET_DRIFTTYPUVC: 2; PACKAGE: P0008A; PACKAGE_DESCRIPTION: 8-Pin Plastic In-Line, Body 9.59 x 6.35 mm, Pitch 2.54 mm; PACKAGE_VERSION: 4040082/E, 04/2010; PACKING: TUBE; PREFIX: U; RATING: Catalog; RELEASE_DATE: 1464326322; SLEW_RATETYPVUS: 0.55; SUB_FAMILY: Low Power Amp (<=500uA), Precision Amplifier; TOTAL_SUPPLY_VOLTAGEMAX5V_IS_5__5V_IS_10: 16; TOTAL_SUPPLY_VOLTAGEMIN5V_IS_5__5V_IS_10: 4.4; VAULT_GUID: 72ECF672-6631-4BE1-B924-9F2EC9DC95E1; VAULT_REVISION: FFCFF6B7-DEC0-4923-AD0B-2C26D64746E9; VIO_25CMAXMV: 2.5
U6 = AD623ANZ:AD623ANZ: Single-Supply, Rail-to-Rail, Low Cost Instrumentation Amplifier; AVAILABILITY: Unavailable; DESCRIPTION: Instrumentation Amplifier 1 Circuit Rail-to-Rail 8-PDIP; MF: Analog Devices; MP: AD623ANZ; PACKAGE: PDIP-8 Analog Devices; PRICE: None
U7 = Texas Instruments - TLC2264CN:TEXAS_INSTRUMENTS_TLC2264CN: TI-TLC_TLV-14; CIIVA_IDS: 13615389; CMRR_MIND_B: 70; CODE__JEDEC: MS-001; COMPONENT_LINK_1_DESCRIPTION: Manufacturer URL; COMPONENT_LINK_1_URL: http://www.ti.com/; COMPONENT_LINK_3_DESCRIPTION: Package Specification; COMPONENT_LINK_3_URL: http://www.ti.com/lit/ml/mpdi002c/mpdi002c.pdf; DATASHEET: http://www.ti.com/lit/ds/symlink/tlc2264.pdf; DATASHEET_VERSION: SLOS177D; ECO__PLAN: Pb-Free (RoHS); FOOTPRINT_VARIANT_NAME_0: Manufacturer Recommended; GBW_TYP_MHZ: 0.71; IIB_MAXP_A: 100; IMPORTED: yes; IMPORTED_FROM: vault; IMPORT_TS: 1521851278; IQ_PER_CHANNELMAXMA: 0.25; MF: Texas Instruments; MOUNTING_TECHNOLOGY: Through Hole; MPN: TLC2264CN; NUMBER_OF_CHANNELS: 4; OFFSET_DRIFTTYPUVC: 2; PACKAGE: N0014A; PACKAGE_DESCRIPTION: 14-Pin Plastic In-Line, Body 19.305 x 6.35 mm, Pitch 2.54 mm; PACKAGE_VERSION: 4040049/E, 12/2002; PACKING: TUBE; PREFIX: U; RATING: Catalog; RELEASE_DATE: 1464311409; SLEW_RATETYPVUS: 0.55; TOTAL_SUPPLY_VOLTAGEMAX5V_IS_5__5V_IS_10: 16; TOTAL_SUPPLY_VOLTAGEMIN5V_IS_5__5V_IS_10: 4.4; VAULT_GUID: CC2D83C9-2961-4D52-8AD6-81F6368DD5C4; VAULT_REVISION: 132A229D-CFE2-4788-A711-83CB80B27A2B; VIO_25CMAXMV: 2.5
U8 U9 = SC-10-30J:SC-10-30J: Common Mode Choke THT AC 10A 3mH Source: Datasheet <http://www.kemet.com/docfinder?Partnumber=SC-10-30J>; DESCRIPTION: Common Mode Choke THT AC 10A 3mH; HEIGHT: mm; MANUFACTURER_NAME: Kemet; MANUFACTURER_PART_NUMBER: SC-10-30J; MOUSER_PART_NUMBER: 80-SC-10-30J; MOUSER_PRICE-STOCK: https://www.mouser.com/Search/Refine.aspx?Keyword=80-SC-10-30J; RS_PART_NUMBER: 8633778P; RS_PRICE-STOCK: http://uk.rs-online.com/web/p/products/8633778P
U10 = STM32F103C8T6:STM32F103C8T6: Mainstream Performance line, ARM Cortex-M3 MCU with 64 Kbytes Flash, 72 MHz CPU, motor control, USB and CAN; AVAILABILITY: Unavailable; DESCRIPTION: ARM® Cortex®-M3 STM32F1 Microcontroller IC 32-Bit 72MHz 64KB _64K x 8_ FLASH; MF: STMicroelectronics; MP: STM32F103C8T6; PACKAGE: LQFP-48 STMicroelectronics; PRICE: None
Y1 = 080-20:FOX_ELECTRONICS_FOXSLF-080-20: XTAL-1-2-2; CASE_PACKAGE: TO-263-3; COMPONENT_LINK_1_DESCRIPTION: Manufacturer URL; COMPONENT_LINK_1_URL: http://www.foxonline.com/; DATASHEET: http://download.siliconexpert.com/pdfs/2015/4/5/6/5/7/200/fox_/manual/35607121449963728hc49slf.pdf; DATASHEET_VERSION: Mar-15; DROPOUT_VOLTAGE: 2 V; HEIGHT: 30.02 mm; IMPORTED: yes; IMPORTED_FROM: vault; IMPORT_TS: 1521190278; LENGTH: 10.24 mm; MAX_INPUT_VOLTAGE: 35 V; MAX_OPERATING_TEMPERATURE: 125 degC; MAX_OUPUT_CURRENT: 1 A; MF: Fox Electronics; MIN_INPUT_VOLTAGE: 7 V; MIN_OPERATING_TEMPERATURE: 0 degC; MOUNT: Surface Mount; MPN: FOXSLF/080-20; NOMINAL_OUTPUT_VOLTAGE: 5 V; OUTPUTS: 1; OUTPUT_CURRENT: 1 A; OUTPUT_VOLTAGE: 5 V; PACKAGE: FOXSLF080-20; PACKAGE_DESCRIPTION: 2-Pin Through Hole Device, Body 11.35 x 4.65 mm; PACKAGE_QUANTITY: 50; PACKAGING: Rail/Tube; PINS: 3; PREFIX: Y; RADIATION_HARDENING: No; REACH_SVHC: No SVHC; RO_HSCOMPLIANT: true; VAULT_GUID: 65BF2B40-1F3A-48FE-AAE0-3293605D335B; VAULT_REVISION: 2FABA449-575F-41E0-9224-530642AA36D8; WIDTH: 9.35 mm
Y2 = SamacSys_Parts:CSTLS16M0X53Z-A0: Resonators 16.0MHz +/-0.5% Ceramic Resonator Source: Datasheet <https://componentsearchengine.com/Datasheets/1/CSTLS16M0X53Z-A0.pdf>; DESCRIPTION: Resonators 16.0MHz +/-0.5% Ceramic Resonator; HEIGHT: 7mm; MANUFACTURER_NAME: Murata Electronics; MANUFACTURER_PART_NUMBER: CSTLS16M0X53Z-A0; MOUSER_PART_NUMBER: 81-CSTLS16M0X53Z-A0; MOUSER_PRICE-STOCK: https://www.mouser.com/Search/Refine.aspx?Keyword=81-CSTLS16M0X53Z-A0